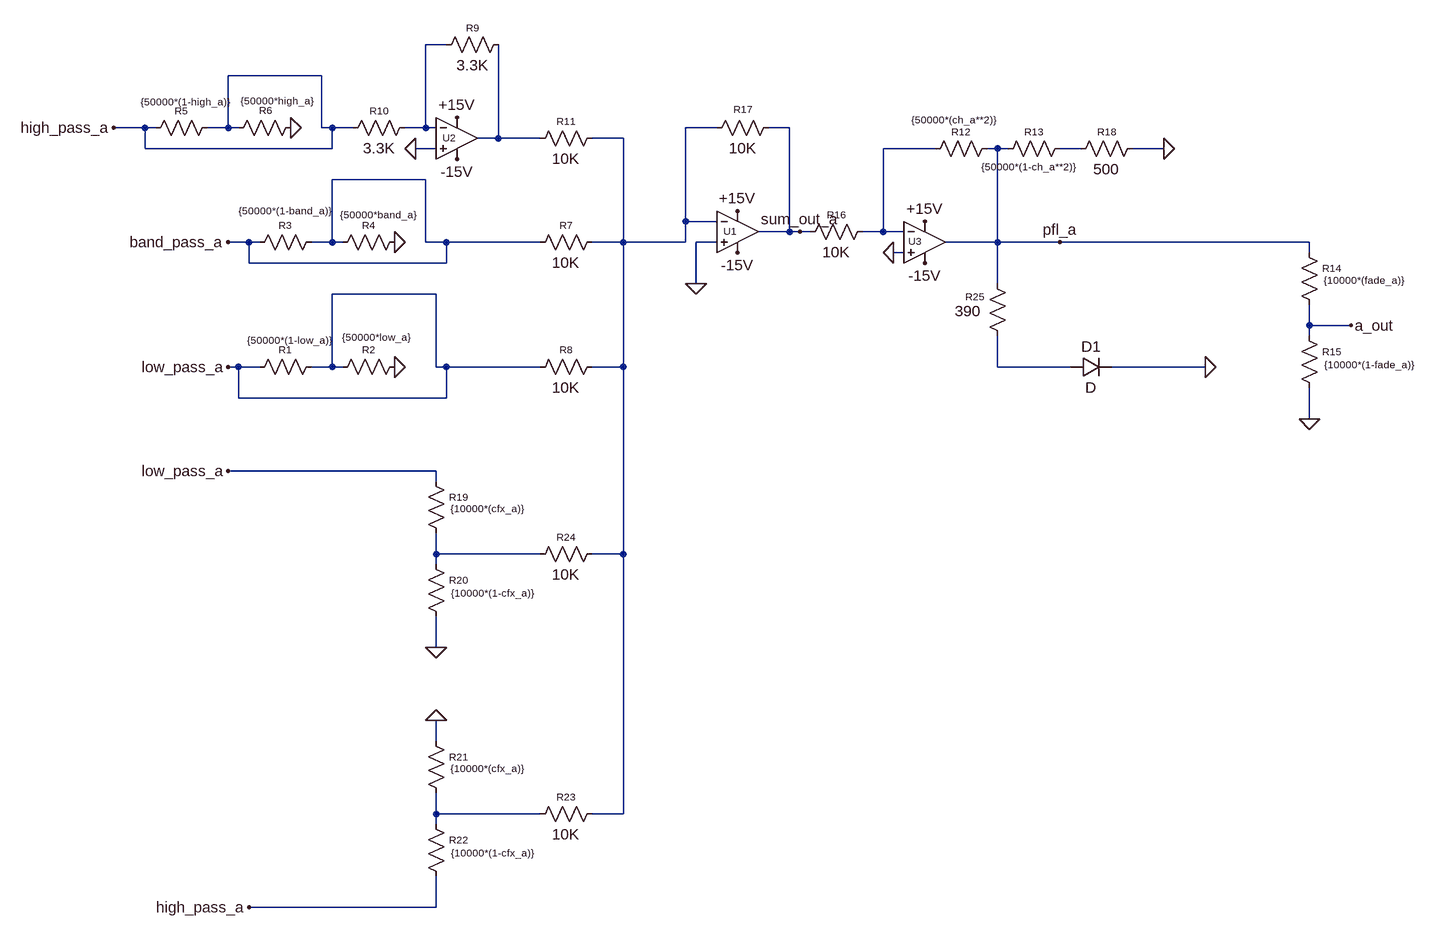
[diagram p0: schematic Gain_and_Channel_Fader.asc]
Gain_and_Channel_Fader.asc, the LTspice schematic file:
Version 4.1
SHEET 1 1804 844
WIRE 288 -544 256 -544
WIRE 96 -496 -48 -496
WIRE -176 -416 -224 -416
WIRE -160 -416 -176 -416
WIRE -48 -416 -48 -496
WIRE -48 -416 -80 -416
WIRE -32 -416 -48 -416
WIRE 96 -416 96 -496
WIRE 112 -416 96 -416
WIRE 144 -416 112 -416
WIRE 256 -416 256 -544
WIRE 256 -416 224 -416
WIRE 272 -416 256 -416
WIRE 704 -416 656 -416
WIRE 816 -416 784 -416
WIRE 368 -400 368 -544
WIRE 368 -400 336 -400
WIRE 432 -400 368 -400
WIRE 560 -400 512 -400
WIRE -176 -384 -176 -416
WIRE 112 -384 112 -416
WIRE 112 -384 -176 -384
WIRE 272 -384 240 -384
WIRE 1040 -384 960 -384
WIRE 1136 -384 1120 -384
WIRE 1152 -384 1136 -384
WIRE 1264 -384 1232 -384
WIRE 1392 -384 1344 -384
WIRE 256 -336 112 -336
WIRE 656 -272 656 -416
WIRE 704 -272 656 -272
WIRE 816 -256 816 -416
WIRE 816 -256 768 -256
WIRE 832 -256 816 -256
WIRE 848 -256 832 -256
WIRE 960 -256 960 -384
WIRE 960 -256 928 -256
WIRE 992 -256 960 -256
WIRE -16 -240 -48 -240
WIRE 0 -240 -16 -240
WIRE 112 -240 112 -336
WIRE 112 -240 80 -240
WIRE 128 -240 112 -240
WIRE 256 -240 256 -336
WIRE 288 -240 256 -240
WIRE 432 -240 288 -240
WIRE 560 -240 560 -400
WIRE 560 -240 512 -240
WIRE 656 -240 656 -272
WIRE 656 -240 560 -240
WIRE 704 -240 672 -240
WIRE 1136 -240 1136 -384
WIRE 1136 -240 1056 -240
WIRE 1232 -240 1136 -240
WIRE 1616 -240 1232 -240
WIRE 992 -224 976 -224
WIRE 1616 -224 1616 -240
WIRE -16 -208 -16 -240
WIRE 288 -208 288 -240
WIRE 288 -208 -16 -208
WIRE 672 -176 672 -240
WIRE 1136 -176 1136 -240
WIRE 272 -160 112 -160
WIRE 1616 -112 1616 -144
WIRE 1680 -112 1616 -112
WIRE 1616 -96 1616 -112
WIRE -32 -48 -48 -48
WIRE 0 -48 -32 -48
WIRE 112 -48 112 -160
WIRE 112 -48 80 -48
WIRE 128 -48 112 -48
WIRE 272 -48 272 -160
WIRE 288 -48 272 -48
WIRE 432 -48 288 -48
WIRE 560 -48 560 -240
WIRE 560 -48 512 -48
WIRE 1136 -48 1136 -96
WIRE 1248 -48 1136 -48
WIRE 1456 -48 1312 -48
WIRE -32 0 -32 -48
WIRE 288 0 288 -48
WIRE 288 0 -32 0
WIRE 1616 32 1616 -16
WIRE 272 112 -48 112
WIRE 272 128 272 112
WIRE 272 240 272 208
WIRE 432 240 272 240
WIRE 560 240 560 -48
WIRE 560 240 512 240
WIRE 272 256 272 240
WIRE 272 384 272 336
WIRE 272 528 272 496
WIRE 272 640 272 608
WIRE 432 640 272 640
WIRE 560 640 560 240
WIRE 560 640 512 640
WIRE 272 656 272 640
WIRE 272 784 272 736
WIRE 272 784 -16 784
FLAG -48 -48 low_pass_a
FLAG -48 -240 band_pass_a
FLAG -224 -416 high_pass_a
FLAG 672 -176 0
FLAG 736 -224 -15V
FLAG 736 -288 +15V
FLAG 240 -384 0
FLAG 304 -432 +15V
FLAG 304 -368 -15V
FLAG 1024 -208 -15V
FLAG 1024 -272 +15V
FLAG 976 -224 0
FLAG 1392 -384 0
FLAG 1616 32 0
FLAG 1680 -112 a_out
FLAG 48 -416 0
FLAG 208 -240 0
FLAG 208 -48 0
FLAG -48 112 low_pass_a
FLAG -16 784 high_pass_a
FLAG 272 384 0
FLAG 272 496 0
FLAG 832 -256 sum_out_a
FLAG 1456 -48 0
FLAG 1232 -240 pfl_a
SYMBOL res -16 -32 R270
WINDOW 0 32 56 VTop 1
WINDOW 3 68 62 VBottom 1
SYMATTR InstName R1
SYMATTR Value {50000*(1-low_a)}
SYMATTR SpiceLine tol=1
SYMBOL res 112 -32 R270
WINDOW 0 32 56 VTop 1
WINDOW 3 72 67 VBottom 1
SYMATTR InstName R2
SYMATTR Value {50000*low_a}
SYMATTR SpiceLine tol=1
SYMBOL res -16 -224 R270
WINDOW 0 32 56 VTop 1
WINDOW 3 75 55 VBottom 1
SYMATTR InstName R3
SYMATTR Value {50000*(1-band_a)}
SYMATTR SpiceLine tol=1
SYMBOL res 112 -224 R270
WINDOW 0 32 56 VTop 1
WINDOW 3 69 70 VBottom 1
SYMATTR InstName R4
SYMATTR Value {50000*band_a}
SYMATTR SpiceLine tol=1
SYMBOL res -176 -400 R270
WINDOW 0 32 56 VTop 1
WINDOW 3 67 61 VBottom 1
SYMATTR InstName R5
SYMATTR Value {50000*(1-high_a)}
SYMATTR SpiceLine tol=1
SYMBOL res -48 -400 R270
WINDOW 0 33 58 VTop 1
WINDOW 3 68 74 VBottom 1
SYMATTR InstName R6
SYMATTR Value {50000*high_a}
SYMATTR SpiceLine tol=1
SYMBOL res 528 -256 R90
WINDOW 0 0 56 VBottom 1
WINDOW 3 32 56 VTop 2
SYMATTR InstName R7
SYMATTR Value 10K
SYMATTR SpiceLine tol=1
SYMBOL res 528 -64 R90
WINDOW 0 0 56 VBottom 1
WINDOW 3 32 56 VTop 2
SYMATTR InstName R8
SYMATTR Value 10K
SYMATTR SpiceLine tol=1
SYMBOL OpAmps\\UniversalOpAmp2 736 -256 R0
WINDOW 0 -22 -1 Left 1
SYMATTR InstName U1
SYMATTR Value2 Avol=200K GBW=10Meg Slew=9Meg
SYMATTR SpiceLine Ilimit=30m Rail=0 Vos=0
SYMBOL OpAmps\\UniversalOpAmp2 304 -400 R0
WINDOW 0 -22 -1 Left 1
SYMATTR InstName U2
SYMATTR Value2 Avol=200K GBW=10Meg Slew=9Meg
SYMATTR SpiceLine Ilimit=30m Rail=0 Vos=0
SYMBOL res 384 -560 R90
WINDOW 0 0 56 VBottom 1
WINDOW 3 32 56 VTop 2
SYMATTR InstName R9
SYMATTR Value 3.3K
SYMATTR SpiceLine tol=1
SYMBOL res 240 -432 R90
WINDOW 0 0 56 VBottom 1
WINDOW 3 32 56 VTop 2
SYMATTR InstName R10
SYMATTR Value 3.3K
SYMATTR SpiceLine tol=1
SYMBOL res 528 -416 R90
WINDOW 0 0 56 VBottom 1
WINDOW 3 32 56 VTop 2
SYMATTR InstName R11
SYMATTR Value 10K
SYMATTR SpiceLine tol=1
SYMBOL OpAmps\\UniversalOpAmp2 1024 -240 R0
WINDOW 0 -25 -2 Left 1
SYMATTR InstName U3
SYMATTR Value2 Avol=200K GBW=10Meg Slew=9Meg
SYMATTR SpiceLine Ilimit=30m Rail=0 Vos=0
SYMBOL res 1024 -368 R270
WINDOW 0 32 56 VTop 1
WINDOW 3 71 44 VBottom 1
SYMATTR InstName R12
SYMATTR Value {50000*(ch_a**2)}
SYMATTR SpiceLine tol=1
SYMBOL res 1136 -368 R270
WINDOW 0 32 56 VTop 1
WINDOW 3 -1 47 VBottom 1
SYMATTR InstName R13
SYMATTR Value {50000*(1-ch_a**2)}
SYMATTR SpiceLine tol=1
SYMBOL res 1600 -240 R0
WINDOW 0 36 40 Left 1
WINDOW 3 38 58 Left 1
SYMATTR InstName R14
SYMATTR Value {10000*(fade_a)}
SYMATTR SpiceLine tol=1
SYMBOL res 1600 -112 R0
WINDOW 0 36 40 Left 1
WINDOW 3 39 60 Left 1
SYMATTR InstName R15
SYMATTR Value {10000*(1-fade_a)}
SYMATTR SpiceLine tol=1
SYMBOL res 944 -272 R90
WINDOW 0 0 56 VBottom 1
WINDOW 3 32 56 VTop 2
SYMATTR InstName R16
SYMATTR Value 10K
SYMATTR SpiceLine tol=1
SYMBOL res 688 -400 R270
WINDOW 0 34 56 VTop 1
WINDOW 3 0 56 VBottom 2
SYMATTR InstName R17
SYMATTR Value 10K
SYMATTR SpiceLine tol=1
SYMBOL res 1360 -400 R90
WINDOW 0 0 56 VBottom 1
WINDOW 3 32 56 VTop 2
SYMATTR InstName R18
SYMATTR Value 500
SYMATTR SpiceLine tol=1
SYMBOL res 256 112 R0
WINDOW 0 36 40 Left 1
WINDOW 3 38 58 Left 1
SYMATTR InstName R19
SYMATTR Value {10000*(cfx_a)}
SYMATTR SpiceLine tol=1
SYMBOL res 256 240 R0
WINDOW 0 36 40 Left 1
WINDOW 3 39 60 Left 1
SYMATTR InstName R20
SYMATTR Value {10000*(1-cfx_a)}
SYMATTR SpiceLine tol=1
SYMBOL res 256 512 R0
WINDOW 0 36 40 Left 1
WINDOW 3 38 58 Left 1
SYMATTR InstName R21
SYMATTR Value {10000*(cfx_a)}
SYMATTR SpiceLine tol=1
SYMBOL res 256 640 R0
WINDOW 0 36 40 Left 1
WINDOW 3 39 60 Left 1
SYMATTR InstName R22
SYMATTR Value {10000*(1-cfx_a)}
SYMATTR SpiceLine tol=1
SYMBOL res 528 624 R90
WINDOW 0 0 56 VBottom 1
WINDOW 3 32 56 VTop 2
SYMATTR InstName R23
SYMATTR Value 10K
SYMATTR SpiceLine tol=1
SYMBOL res 528 224 R90
WINDOW 0 0 56 VBottom 1
WINDOW 3 32 56 VTop 2
SYMATTR InstName R24
SYMATTR Value 10K
SYMATTR SpiceLine tol=1
SYMBOL res 1152 -80 R180
WINDOW 0 36 76 Left 1
WINDOW 3 41 54 Left 2
SYMATTR InstName R25
SYMATTR Value 390
SYMATTR SpiceLine tol=1
SYMBOL diode 1248 -32 R270
WINDOW 0 32 32 VTop 2
WINDOW 3 0 32 VBottom 2
SYMATTR InstName D1

The netlist it stands for:
* Gain_and_Channel_Fader.asc
R1 low_pass_a low_pass_a {50000*(1-low_a)} tol=1
R2 low_pass_a 0 {50000*low_a} tol=1
R3 band_pass_a band_pass_a {50000*(1-band_a)} tol=1
R4 band_pass_a 0 {50000*band_a} tol=1
R5 high_pass_a high_pass_a {50000*(1-high_a)} tol=1
R6 high_pass_a 0 {50000*high_a} tol=1
R7 N002 band_pass_a 10K tol=1
R8 N002 low_pass_a 10K tol=1
X§U1 0 N002 +15V -15V sum_out_a level2 Avol=200K GBW=10Meg Slew=9Meg Ilimit=30m Rail=0 Vos=0 En=0 Enk=0 In=0 Ink=0 Rin=500Meg  ; pins In+ In- V+ V- OUT
X§U2 0 N001 +15V -15V N003 level2 Avol=200K GBW=10Meg Slew=9Meg Ilimit=30m Rail=0 Vos=0 En=0 Enk=0 In=0 Ink=0 Rin=500Meg  ; pins In+ In- V+ V- OUT
R9 N003 N001 3.3K tol=1
R10 N001 high_pass_a 3.3K tol=1
R11 N002 N003 10K tol=1
X§U3 0 N004 +15V -15V pfl_a level2 Avol=200K GBW=10Meg Slew=9Meg Ilimit=30m Rail=0 Vos=0 En=0 Enk=0 In=0 Ink=0 Rin=500Meg  ; pins In+ In- V+ V- OUT
R12 N004 pfl_a {50000*(ch_a**2)} tol=1
R13 pfl_a N005 {50000*(1-ch_a**2)} tol=1
R14 pfl_a a_out {10000*(fade_a)} tol=1
R15 a_out 0 {10000*(1-fade_a)} tol=1
R16 N004 sum_out_a 10K tol=1
R17 N002 sum_out_a 10K tol=1
R18 0 N005 500 tol=1
R19 low_pass_a N007 {10000*(cfx_a)} tol=1
R20 N007 0 {10000*(1-cfx_a)} tol=1
R21 0 N008 {10000*(cfx_a)} tol=1
R22 N008 high_pass_a {10000*(1-cfx_a)} tol=1
R23 N002 N008 10K tol=1
R24 N002 N007 10K tol=1
R25 N006 pfl_a 390 tol=1
D1 N006 0 D
.model D D
.lib standard.dio
.lib UniversalOpAmp2.lib
.backanno
.end